# Altium schematic sheet nixieklok.SchDoc
size A4; SheetNumber: 1; SheetTotal: 1
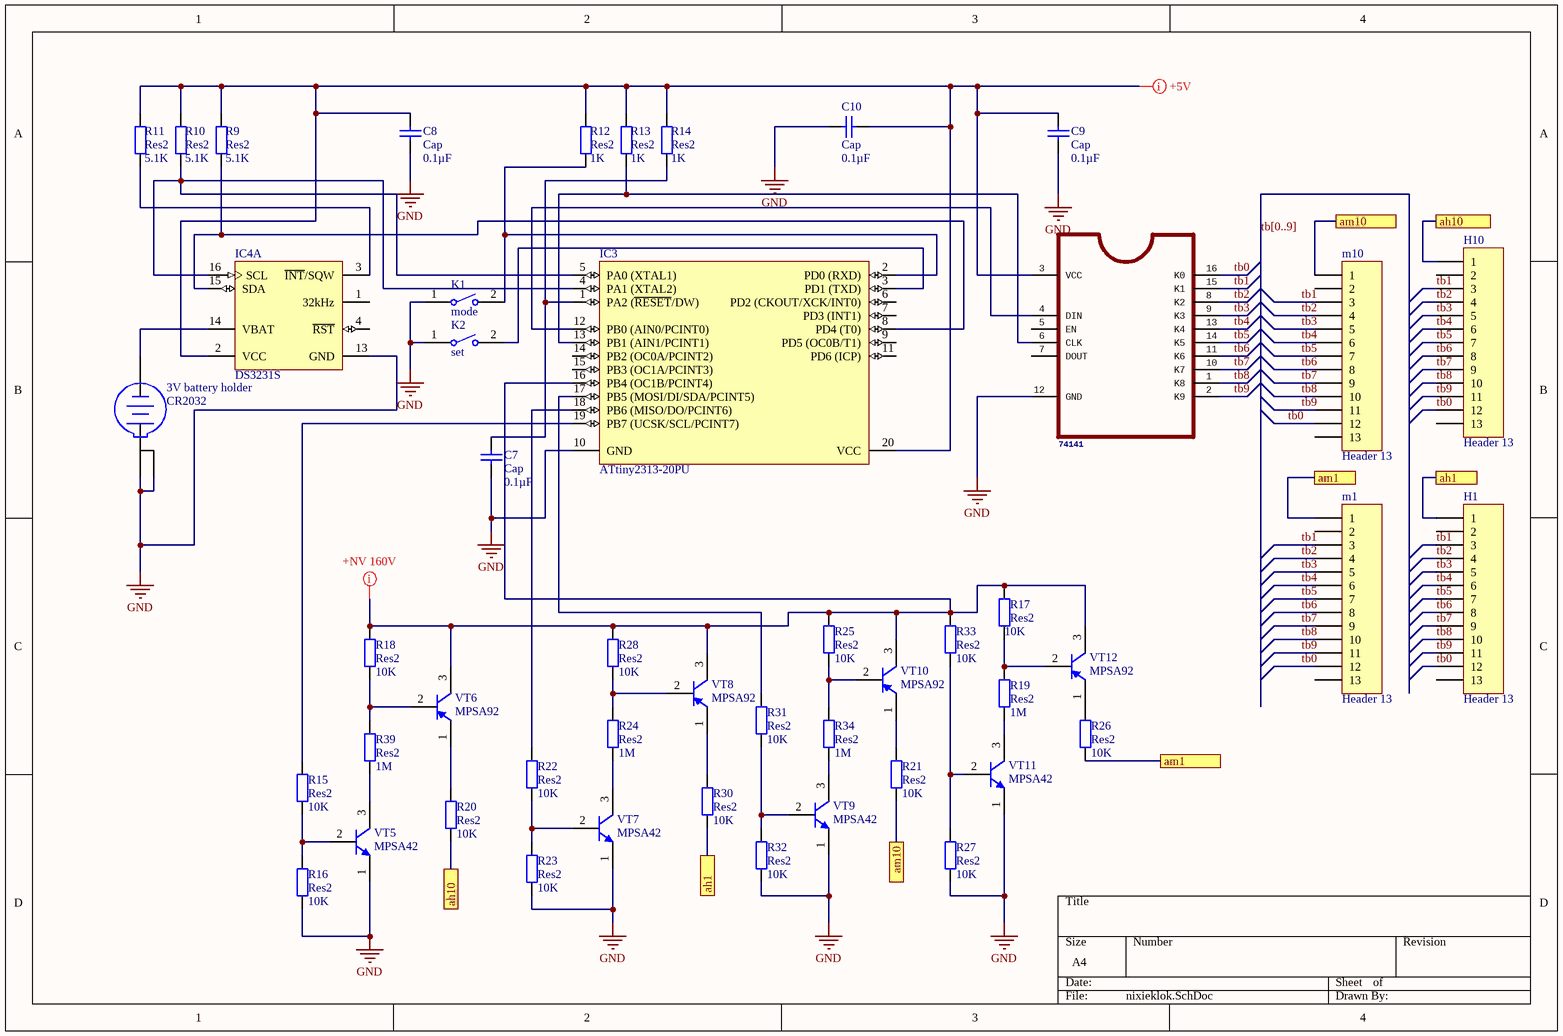
[diagram p0: nixieklok.SchDoc]

## Parts
3V_battery_holder  CR2032  [RENA-HU2032-LF_V]
74141  NIXIE_DRIVER_V1  [DIP-16]  (value not drawn)
C7  Cap  value 0.1µF  [RAD-0.3]
C8  Cap  value 0.1µF  [RAD-0.3]
C9  Cap  value 0.1µF  [RAD-0.3]
C10  Cap  value 0.1µF  [RAD-0.3]
H1  Header 13  [HDR1X13]
H10  Header 13  [HDR1X13]
IC3  ATtiny2313-20PU  [20P3]
IC4  DS3231S  [W16-H2_L]  (part A of 2)
K1  mode  [TECO-FSMSM-2_V]
K2  set  [TECO-FSMSM-2_V]
m1  Header 13  [HDR1X13]
m10  Header 13  [HDR1X13]
R9  Res2  value 5.1K  [AXIAL-0.4]
R10  Res2  value 5.1K  [AXIAL-0.4]
R11  Res2  value 5.1K  [AXIAL-0.4]
R12  Res2  value 1K  [AXIAL-0.4]
R13  Res2  value 1K  [AXIAL-0.4]
R14  Res2  value 1K  [AXIAL-0.4]
R15  Res2  value 10K  [AXIAL-0.4]
R16  Res2  value 10K  [AXIAL-0.4]
R17  Res2  value 10K  [AXIAL-0.4]
R18  Res2  value 10K  [AXIAL-0.4]
R19  Res2  value 1M  [AXIAL-0.4]
R20  Res2  value 10K  [AXIAL-0.4]
R21  Res2  value 10K  [AXIAL-0.4]
R22  Res2  value 10K  [AXIAL-0.4]
R23  Res2  value 10K  [AXIAL-0.4]
R24  Res2  value 1M  [AXIAL-0.4]
R25  Res2  value 10K  [AXIAL-0.4]
R26  Res2  value 10K  [AXIAL-0.4]
R27  Res2  value 10K  [AXIAL-0.4]
R28  Res2  value 10K  [AXIAL-0.4]
R30  Res2  value 10K  [AXIAL-0.4]
R31  Res2  value 10K  [AXIAL-0.4]
R32  Res2  value 10K  [AXIAL-0.4]
R33  Res2  value 10K  [AXIAL-0.4]
R34  Res2  value 1M  [AXIAL-0.4]
R39  Res2  value 1M  [AXIAL-0.4]
VT5  MPSA42  [ONSC-TO-92-3-29-11]
VT6  MPSA92  [ONSC-TO-92-3-29-11]
VT7  MPSA42  [ONSC-TO-92-3-29-11]
VT8  MPSA92  [ONSC-TO-92-3-29-11]
VT9  MPSA42  [ONSC-TO-92-3-29-11]
VT10  MPSA92  [ONSC-TO-92-3-29-11]
VT11  MPSA42  [ONSC-TO-92-3-29-11]
VT12  MPSA92  [ONSC-TO-92-3-29-11]

## Ports
ah1, ah10, am1, am10

## Nets
GND: 3V_battery_holder.1(+) 3V_battery_holder.2(+) 74141.12(GND) C7.1 C8.1 C9.1 C10.1 IC3.10(GND) IC4.13(GND) K1.1 K2.1 R16.1 R23.1 R27.1 R32.1 VT5.1(E) VT7.1(E) VT9.1(E) VT11.1(E)
ah1: H1.1 R30.1 ; port ah1
ah10: H10.1 R20.1 ; port ah10
am1: m1.1 R26.1 ; port am1
am10: m10.1 R21.1 ; port am10
tb0: 74141.16(K0) H1.12 H10.12 m1.12 m10.12
tb1: 74141.15(K1) H1.3 H10.3 m1.3 m10.3
tb2: 74141.8(K2) H1.4 H10.4 m1.4 m10.4
tb3: 74141.9(K3) H1.5 H10.5 m1.5 m10.5
tb4: 74141.13(K4) H1.6 H10.6 m1.6 m10.6
tb5: 74141.14(K5) H1.7 H10.7 m1.7 m10.7
tb6: 74141.11(K6) H1.8 H10.8 m1.8 m10.8
tb7: 74141.10(K7) H1.9 H10.9 m1.9 m10.9
tb8: 74141.1(K8) H1.10 H10.10 m1.10 m10.10
tb9: 74141.2(K9) H1.11 H10.11 m1.11 m10.11
Net3V_battery_holder_3: 3V_battery_holder.3(-) IC4.14(VBAT)
Net74141_3: 74141.3(VCC) C8.2 C9.2 C10.2 IC3.20(VCC) IC4.2(VCC) R9.2 R10.2 R11.2 R12.2 R13.2 R14.2
Net74141_4: 74141.4(DIN) IC3.12(PB0_(AIN0/PCINT0))
Net74141_6: 74141.6(CLK) IC3.13(PB1_(AIN1/PCINT1)) R13.1
NetC7_2: C7.2 IC3.1(PA2_(~{RESET}/DW)) R14.1
NetIC3_2: IC3.2(PD0_(RXD)) K1.2 R12.1
NetIC3_3: IC3.3(PD1_(TXD)) K2.2
NetIC3_4: IC3.4(PA1_(XTAL2)) IC3.5(PA0_(XTAL1)) IC4.16(SCL) R10.1
NetIC3_8: IC3.8(PD4_(T0)) IC4.15(SDA) R9.1
NetIC3_16: IC3.16(PB4_(OC1B/PCINT4)) R17.2 R18.2 R25.2 R28.2 R33.2 VT6.3(C) VT8.3(C) VT10.3(C) VT12.3(C)
NetIC3_17: IC3.17(PB5_(MOSI/DI/SDA/PCINT5)) R31.2
NetIC3_18: IC3.18(PB6_(MISO/DO/PCINT6)) R22.2
NetIC3_19: IC3.19(PB7_(UCSK/SCL/PCINT7)) R15.2
NetIC4_3: IC4.3(~{INT}/SQW) R11.1
NetR15_1: R15.1 R16.2 VT5.2(B)
NetR17_1: R17.1 R19.2 VT12.2(B)
NetR18_1: R18.1 R39.2 VT6.2(B)
NetR19_1: R19.1 VT11.3(C)
NetR20_2: R20.2 VT6.1(E)
NetR21_2: R21.2 VT10.1(E)
NetR22_1: R22.1 R23.2 VT7.2(B)
NetR24_1: R24.1 VT7.3(C)
NetR24_2: R24.2 R28.1 VT8.2(B)
NetR25_1: R25.1 R34.2 VT10.2(B)
NetR26_2: R26.2 VT12.1(E)
NetR27_2: R27.2 R33.1 VT11.2(B)
NetR30_2: R30.2 VT8.1(E)
NetR31_1: R31.1 R32.2 VT9.2(B)
NetR34_1: R34.1 VT9.3(C)
NetR39_1: R39.1 VT5.3(C)

Not connected (* = marked no-connect by the designer): 74141 5(EN) 7(DOUT); H1 2 13; H10 2 13; IC3 6(PD2_(CKOUT/XCK/INT0)) 7(PD3_(INT1)) 9(PD5_(OC0B/T1)) 11(PD6_(ICP)) 14(PB2_(OC0A/PCINT2)) 15(PB3_(OC1A/PCINT3)); IC4 1(32kHz) 4(~{RST}); m1 2 13; m10 2 13

## Buses and harness runs
bus tb[0..9]

## Layout directives
mark named +5V: Net74141_3
mark named +NV 160V: NetIC3_16

## Library data of the parts
3V_battery_holder = CMP-2000-06429-1: Coin Cell Battery Holder, CR2032, Horizontal, -40 to 100 degC, 3-Pin THD, RoHS, Tray; Brand: Renata; Battery Cell Size: 20mm; RoHS: Details; Type: BatteryHolder; Contact Plating: Nickel; Product Category: CoinCellBatteryHolders; Mounting Style: ThroughHole; Factory Pack Quantity: 500; Datasheet Version: Rev. 2, 09/2010; Dimensions: 28.5mmx16.1mmx5.2mm; Package Description: 3-Pin Through Hole Device, Body 28.5 x 16.05 mm; Package Reference: HU2032-LF; Datasheet URL: http://www.renata.com/fileadmin/downloads/productsheets/battery_holders/HU2032-LF.pdf; Product: BatteryHolders; Termination Style: SolderPins; Mounting Technology: ThroughHole; Material: LiquidCrystalPolymer(LCP); Manufacturer URL: http://www.renata.com/; Manufacturer: Renata
74141 = NIXIE_DRIVER_V1: DeviceName: Nixie Driver; SymbolName_1: NIXIE_DRIVER_V1; LibraryName: Nixie_Tube_Driver_Altium_Library; DeviceSetName: NIXIE_DRIVER_V1
C7-C10 = Cap: Capacitor; Published: 8-Jun-2000; LatestRevisionDate: 17-Jul-2002; LatestRevisionNote: Re-released for DXP Platform.; PackageReference: RAD-0.3; Publisher: Altium Limited; PackageDescription: Radial Cap, Thru-Hole; 2 Leads; 0.3 in Pin Spacing
H1 H10 m1 m10 = Header 13: Header, 13-Pin; LatestRevisionDate: 17-Jul-2002; LatestRevisionNote: Re-released for DXP Platform.; Publisher: Altium Limited
IC3 = CMP-0093-00018-2: Low Power tinyAVR® 8-Bit Microcontroller, 2.7-5.5V, 20MHz, 2K Flash Memory, Industrial Grade (-40°C to 85°C), 20-Lead PDIP, Pb-Free; ComponentLink2URL: http://www.atmel.com/dyn/resources/prod_documents/doc2543.pdf; DatasheetVersion: revL, Aug-2010; ComponentLink1Description: Manufacturer URL; PackageVersion: revD, Oct-2010; Code_JEDEC: MS-001-AD; ComponentLink3Description: ATtiny2313 Summary; ComponentLink3URL: http://www.atmel.com/dyn/resources/prod_documents/doc2543S.pdf; PackageDescription: 20-lead (0.300"/7.62mm Wide) Plastic Dual Inline Package (PDIP); PackageReference: 20P3; ComponentLink2Description: ATtiny2313 Datasheet; ComponentLink1URL: http://www.atmel.com/; RevisionNote: DatasheetVersion & PackageVersion updated. URLs added.
IC4 = CMP-0254-00244-1: Extremely Accurate I2C-Integrated Real-Time Clock/TCXO/Crystal, 16-Pin SO, 0 to 70 degC; Code_IPC: SOIC127P1030-16; ComponentLink2Description: Datasheet; ComponentLink1URL: http://www.maxim-ic.com; PackageDescription: 16-Pin Small-Outline IC, Wide (0.3in), 1.27 mm Pitch, SOIC (W); PackageReference: W16-H2; ComponentLink2URL: http://datasheets.maxim-ic.com/en/ds/DS3231.pdf; DatasheetVersion: Rev 8, Jul-2010; PackageVersion: revD, 2010; ComponentLink1Description: Manufacturer URL; ComponentLink3Description: Package Specification; Code_JEDEC: MS-013-AA; ComponentLink3URL: http://pdfserv.maxim-ic.com/package_dwgs/21-0042.PDF
K1 K2 = CMP-2000-07511-1: FSMSM Push Button Switch, 50 mA, -35 to 85 degC, 2-Pin SMD, RoHS, Bulk; Manufacturer: TE Connectivity; Actuator Length: 1.07mm; Electrical Life: 20000Cycles; Actuator Material: Polyamide; Current Rating: 50mA; Illumination Type: Illuminated; Voltage Rating (DC): 24V; Contact Resistance: 100mOhm; Case\/Package: SMD/SMT; Operating Force: 180gf; Switch Travel: 0.25mm; Max Voltage Rating (DC): 12V; Throw Configuration: SPST; Packaging: LoosePiece; Max Operating Temperature: 85degC; ELV: Compliant; Package Description: 2-Pin Surface Mount Device, Body 6 x 3.5 mm, Pitch 9.19 mm; RoHSCompliant: true; Manufacturer URL: http://www.te.com/; Contact Plating: Silver; Contact Material: Brass; Mounting Technology: SurfaceMount; Contact Current Rating: 50mA; Datasheet Version: Rev. C2, 08/2014; Datasheet URL: http://www.te.com/commerce/DocumentDelivery/DDEController?Action=showdoc&DocId=Customer+Drawing%7F1437566-3%7FC2%7Fpdf%7FEnglish%7FENG_CD_1437566-3_C2_1437566_3_1_c.dwg.pdf%7F1437566-3; Mechanical Life: 20000Cycles; Package Reference: FSMSM; REACH SVHC: Unknown; Orientation: Straight; Min Operating Temperature: -35degC; Lead Free: LeadFree; Termination: GullWing; Package Quantity: 1000; Mount: SurfaceMount
R9-R28 R30-R34 R39 = Res2: Resistor; Published: 8-Jun-2000; LatestRevisionDate: 17-Jul-2002; LatestRevisionNote: Re-released for DXP Platform.; PackageReference: AXIAL-0.4; Publisher: Altium Limited; PackageDescription: Axial Device, Thru-Hole; 2 Leads; 0.4 in Pin Spacing
VT5 VT7 VT9 VT11 = CMP-1048-01390-1: High Voltage Transistor, NPN Silicon, 3-Pin TO-92, Bulk Box; Manufacturer: On Semiconductor; fT Min (MHz): 50; Note1: 0; IC Continuous (A): 0.5; ComponentLink3Description: Package Specification; PackageReference: TO-92-3-29-11_AM_SL; Packing: Bulk Box; ComponentLink1URL: http://www.onsemi.com/; PackageDescription: 3-Pin Transistor Outline, Body 4.825 x 3.685 mm, Pitch 1.27 mm; Mounting Technology: Through Hole; RoHS: FALSE; DatasheetVersion: Rev. 8; PackageVersion: Rev. AM; ComponentLink2Description: Datasheet; ComponentLink1Description: Manufacturer URL; ComponentLink2URL: http://www.onsemi.cn/pub_link/Collateral/MPSA42-D.PDF; ComponentLink3URL: http://www.onsemi.cn/pub_link/Collateral/2N6426-D.PDF; Polarity: NPN; PartNumber: MPSA42
VT6 VT8 VT10 VT12 = CMP-1048-01411-1: High Voltage Transistor, PNP Silicon, 3-Pin TO-92, Bulk Box; Manufacturer: On Semiconductor; fT Min (MHz): 50; IC Continuous (A): -0.5; ComponentLink2Description: Datasheet; DatasheetVersion: Rev. 6; Polarity: PNP; ComponentLink2URL: http://www.onsemi.cn/pub_link/Collateral/MPSA92-D.PDF; PackageVersion: Rev. AM; ComponentLink1URL: http://www.onsemi.com/; Packing: Bulk Box; RoHS: FALSE; PackageDescription: 3-Pin Transistor Outline, Body 4.825 x 3.685 mm, Pitch 1.27 mm; ComponentLink3Description: Package Specification; PackageReference: TO-92-3-29-11_AM_SL; ComponentLink3URL: http://www.onsemi.cn/pub_link/Collateral/2N6426-D.PDF; ComponentLink1Description: Manufacturer URL; Mounting Technology: Through Hole; PartNumber: MPSA92